# EAGLE design SFX100_LeonardoBreakout (EAGLE 9.3.2)
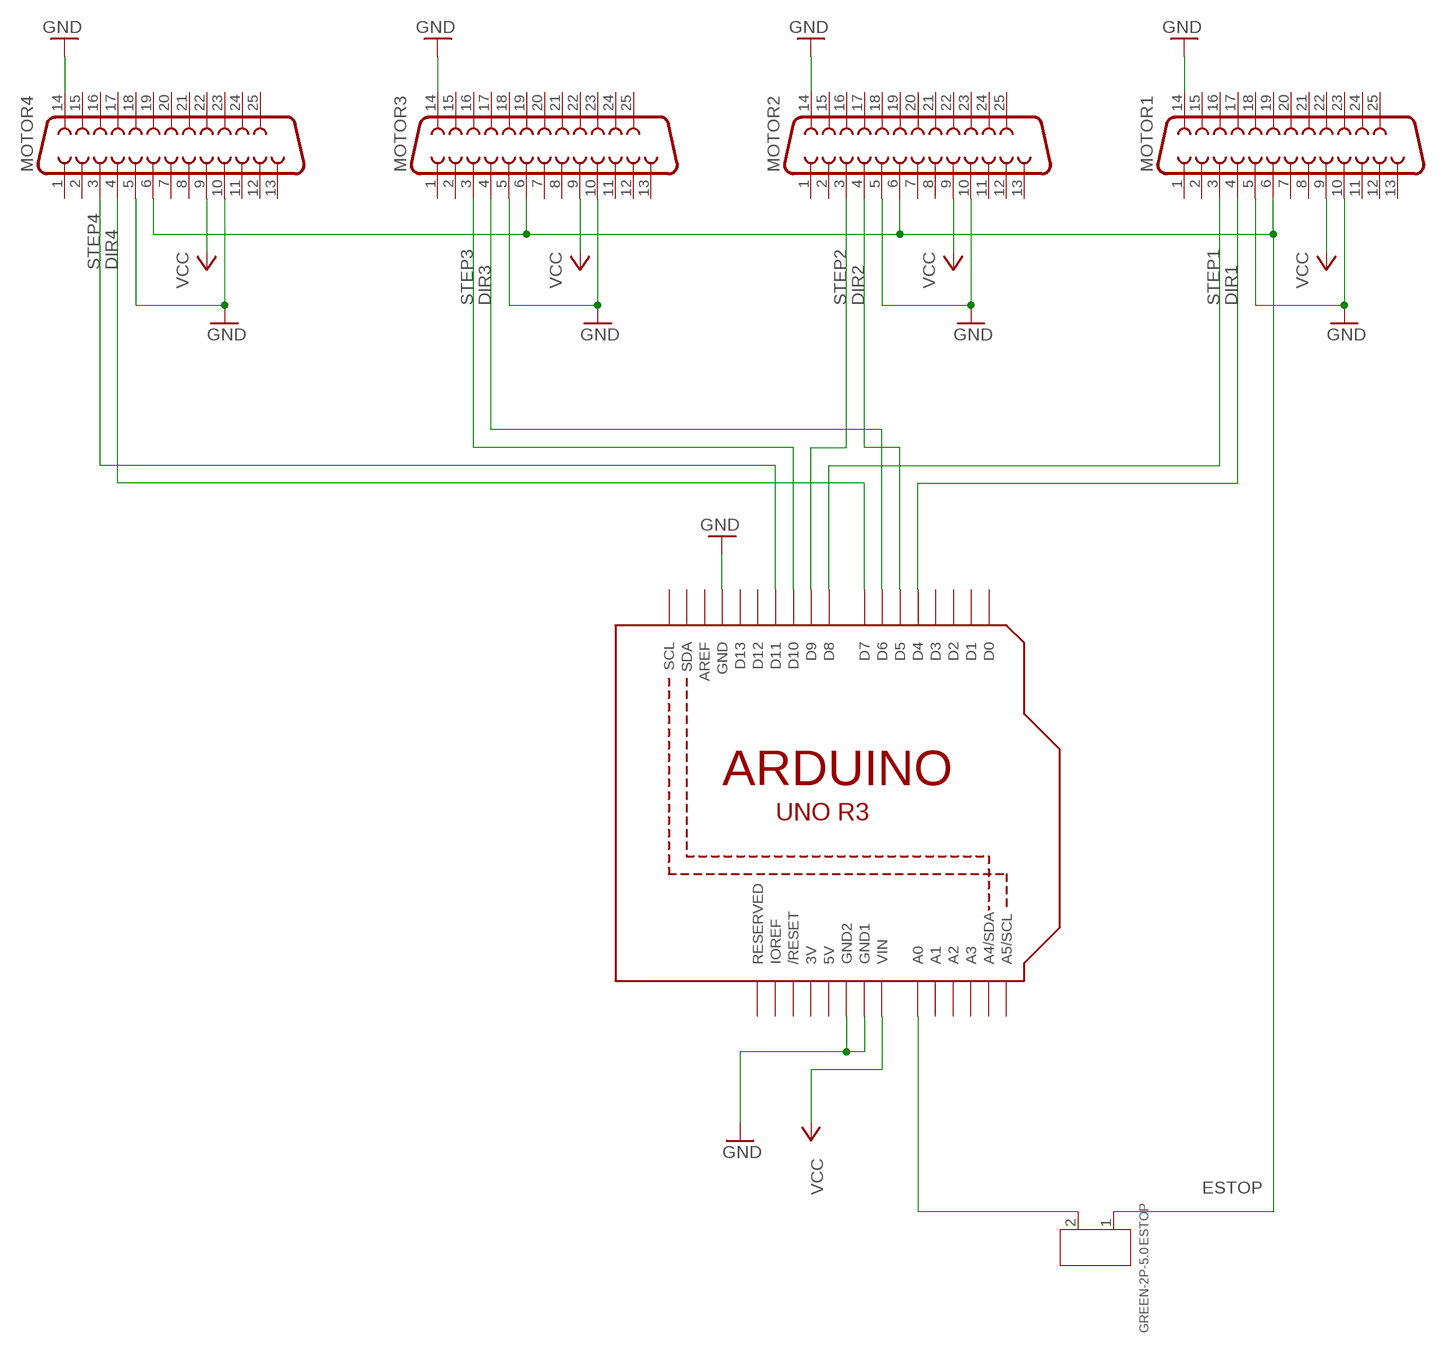
[diagram p0: schematic, sheet 1]

## Parts
ESTOP  GREEN-2P-5.0  SCREW-TERMINAL-GREEN(2P-5.0)  [H2-5.0-10.5X8.0MM]
MOTOR1  F25V  [F25V]
MOTOR2  F25V  [F25V]
MOTOR3  F25V  [F25V]
MOTOR4  F25V  [F25V]
U1  ARDUINOR3-BPLACE  [ARDUINOR3-BPLACE]

## Nets
DIR1: MOTOR1.4 U1.D4
DIR2: MOTOR2.4 U1.D5
DIR3: MOTOR3.4 U1.D6
DIR4: MOTOR4.4 U1.D7
ENA: ESTOP.2 U1.A0
ESTOP: ESTOP.1 MOTOR1.6 MOTOR2.6 MOTOR3.6 MOTOR4.6
GND: MOTOR1.5 MOTOR1.10 MOTOR1.14 MOTOR2.5 MOTOR2.10 MOTOR2.14 MOTOR3.5 MOTOR3.10 MOTOR3.14 MOTOR4.5 MOTOR4.10 MOTOR4.14 U1.GND U1.GND1 U1.GND2
STEP1: MOTOR1.3 U1.D8
STEP2: MOTOR2.3 U1.D9
STEP3: MOTOR3.3 U1.D10
STEP4: MOTOR4.3 U1.D11
VCC: MOTOR1.9 MOTOR2.9 MOTOR3.9 MOTOR4.9 U1.VIN
Unconnected: MOTOR1.1 MOTOR1.2 MOTOR1.7 MOTOR1.8 MOTOR1.11 MOTOR1.12 MOTOR1.13 MOTOR1.15 MOTOR1.16 MOTOR1.17 MOTOR1.18 MOTOR1.19 MOTOR1.20 MOTOR1.21 MOTOR1.22 MOTOR1.23 MOTOR1.24 MOTOR1.25 MOTOR2.1 MOTOR2.2 MOTOR2.7 MOTOR2.8 MOTOR2.11 MOTOR2.12 MOTOR2.13 MOTOR2.15 MOTOR2.16 MOTOR2.17 MOTOR2.18 MOTOR2.19 MOTOR2.20 MOTOR2.21 MOTOR2.22 MOTOR2.23 MOTOR2.24 MOTOR2.25 MOTOR3.1 MOTOR3.2 MOTOR3.7 MOTOR3.8 MOTOR3.11 MOTOR3.12 MOTOR3.13 MOTOR3.15 MOTOR3.16 MOTOR3.17 MOTOR3.18 MOTOR3.19 MOTOR3.20 MOTOR3.21 MOTOR3.22 MOTOR3.23 MOTOR3.24 MOTOR3.25 MOTOR4.1 MOTOR4.2 MOTOR4.7 MOTOR4.8 MOTOR4.11 MOTOR4.12 MOTOR4.13 MOTOR4.15 MOTOR4.16 MOTOR4.17 MOTOR4.18 MOTOR4.19 MOTOR4.20 MOTOR4.21 MOTOR4.22 MOTOR4.23 MOTOR4.24 MOTOR4.25 U1.A1 U1.A2 U1.A3 U1.A4(A4/SDA) U1.A5(A5/SCL) U1.AREF U1.D0 U1.D1 U1.D2 U1.D3 U1.D12 U1.D13 U1.IOREF U1.RESERVED U1.RESET(/RESET) U1.SCL U1.SDA

## Power pins joined to a net without a drawn wire
3V: U1.3V
5V: U1.5V

## Library data of the parts
ESTOP = OPL_Connector:SCREW-TERMINAL-GREEN(2P-5.0): 320110031
MOTOR1-MOTOR4 = con-subd:F25: SUB-D; OC_FARNELL: unknown; OC_NEWARK: unknown
U1 = adafruit:ARDUINOR3: This is a new object for the new Arduino R3 - with extra pins that you may want to use (such as IOref, and duplicated A4/A5

## Net classes
0 default: width 0.254 mm, clearance 0.254 mm

## Board
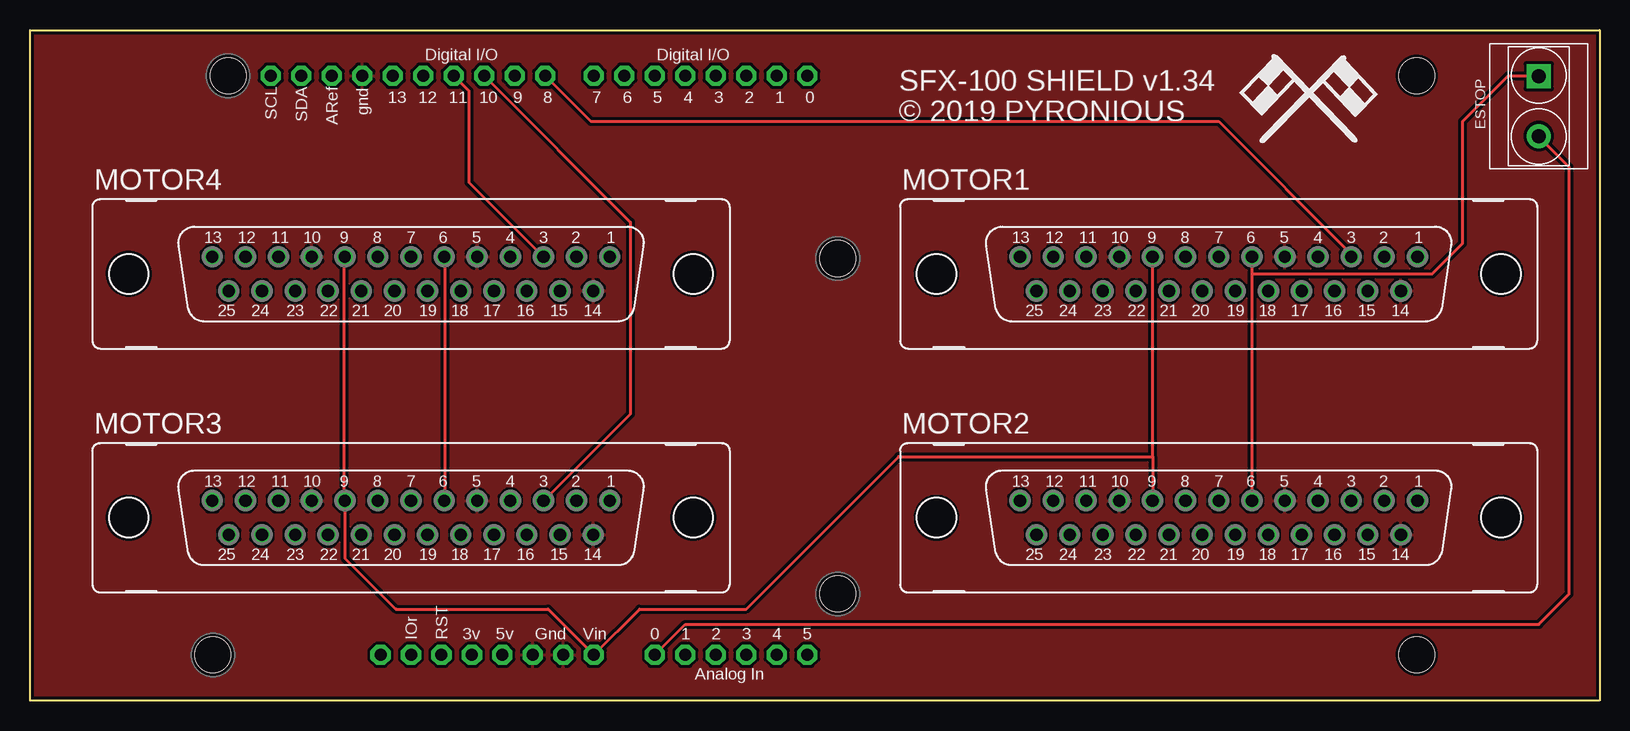
[diagram p1: board, top side]
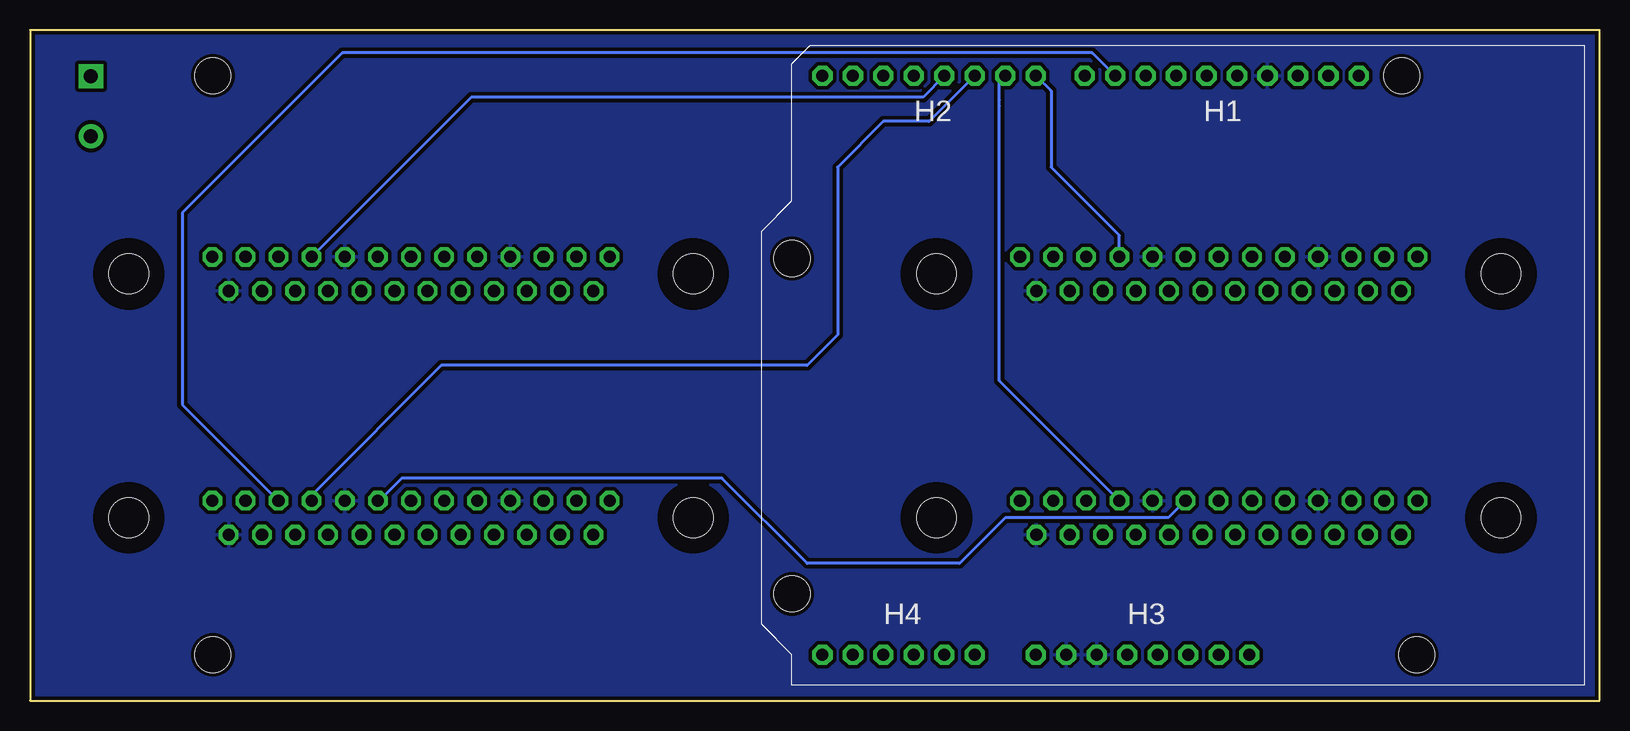
[diagram p2: board, bottom side, seen from below]

Size 130.81 x 55.88 mm. Coordinates in mm from the lower left corner, seen from the top.
Outline: 0,55.88 130.81,55.88 130.81,0 0,0 0,55.88
Copper layers (1*16): Top 0.035mm / dielectric 1.5mm / Bottom 0.035mm
Design rules "SparkFun": minimum track width 8mil, minimum drill 20mil, track to track 8mil, track to pad 8mil, pad to pad 8mil, via to via 8mil, smd to smd 8mil, copper to edge 10mil, drill to drill 8mil, minimum pad ring 12mil, minimum via ring 10mil, stop-mask expansion 4mil, vias tented up to drill 25mil, thermal gap 10mil
Holes 3 mm at 16.51,52.07 15.24,3.81 67.31,8.89 67.31,36.83 115.57,52.07 115.57,3.81

### Footprints (pad centres in the part's own frame; a part is rotated, then mirrored left to right if it is on the bottom)
H2-5.0-10.5X8.0MM = drill 1.168 pad 2.032 square: 1 0,2.5 | drill 1.168 pad 2.032: 2 0,-2.5
F25V = drill 1.016 octagon: 1 16.561,1.422; 2 13.792,1.422; 3 11.049,1.422; 4 8.28,1.422; 5 5.512,1.422; 6 2.769,1.422; 7 0,1.422; 8 -2.769,1.422; 9 -5.512,1.422; 10 -8.28,1.422; 11 -11.049,1.422; 12 -13.792,1.422; 13 -16.561,1.422; 14 15.189,-1.422; 15 12.421,-1.422; 16 9.652,-1.422; 17 6.909,-1.422; 18 4.14,-1.422; 19 1.372,-1.422; 20 -1.372,-1.422; 21 -4.14,-1.422; 22 -6.909,-1.422; 23 -9.652,-1.422; 24 -12.421,-1.422; 25 -15.189,-1.422 | hole 3.302: 23.52,0; -23.52,0
ARDUINOR3-BPLACE = drill 1 pad 1.676 octagon: 3V 35.56,2.54; 5V 38.1,2.54; A0 50.8,2.54; A1 53.34,2.54; A2 55.88,2.54; A3 58.42,2.54; A4 60.96,2.54; A5 63.5,2.54; AREF 23.876,50.8; D0 63.5,50.8; D1 60.96,50.8; D2 58.42,50.8; D3 55.88,50.8; D4 53.34,50.8; D5 50.8,50.8; D6 48.26,50.8; D7 45.72,50.8; D8 41.656,50.8; D9 39.116,50.8; D10 36.576,50.8; D11 34.036,50.8; D12 31.496,50.8; D13 28.956,50.8; GND 26.416,50.8; GND1 43.18,2.54; GND2 40.64,2.54; IOREF 30.48,2.54; RESERVED 27.94,2.54; RESET 33.02,2.54; SCL 18.796,50.8; SDA 21.336,50.8; VIN 45.72,2.54

### Placement (x,y rotation side)
ESTOP  125.73,49.53 0 top
MOTOR1  99.06,35.56 0 top
MOTOR2  99.06,15.24 0 top
MOTOR3  31.75,15.24 0 top
MOTOR4  31.75,35.56 0 top
U1  1.27,1.27 0 top

### Tracks (layer width: path | path; a pad name or v marks a point on that pad's centre or on a via)
DIR1
  Bottom 0.254: U1.D4 56.39,50.29 94.03,50.29 MOTOR1.4
DIR2
  Bottom 0.254: U1.D5 55.88,48.26 59.69,48.26 63.5,44.45 63.5,30.48 66.04,27.94 96.52,27.94 107.34,17.12 MOTOR2.4
DIR3
  Bottom 0.254: MOTOR3.4 50.04,26.67 50.04,49.53 50.04,50.04 50.04,51.56 U1.D6
DIR4
  Bottom 0.254: U1.D7 45.72,50.8 45.72,44.45 40.03,38.76 MOTOR4.4
ENA
  Top 0.254: U1.A0 54.61,6.35 125.73,6.35 128.27,8.89 128.27,44.45 125.73,46.99 ESTOP.2
ESTOP
  Top 0.254: MOTOR3.6 34.54,16.76 34.54,36.83 MOTOR4.6 | MOTOR2.6 101.85,16.76 101.83,16.79 101.83,35.56 | ESTOP.1 125.73,52.07 123.19,52.07 119.38,48.26 119.38,38.1 116.84,35.56 101.83,35.56 | MOTOR1.6 101.83,35.56
  Bottom 0.254: MOTOR2.6 101.6,16.76 99.82,18.54 73.15,18.54 66.04,11.43 53.34,11.43 49.53,15.24 35.94,15.24 MOTOR3.6
GND
  pour Top: 0,55.88 130.81,55.88 130.81,0 0,0
  pour Bottom (isolate 0.305): 0,55.88 130.81,55.88 130.81,0 0,0
STEP1
  Top 0.254: U1.D8 46.74,48.26 99.06,48.26 110.11,37.21 MOTOR1.3
STEP2
  Bottom 0.254: U1.D9 42.29,53.98 104.77,53.98 118.11,40.64 118.11,24.66 MOTOR2.3
STEP3
  Top 0.254: U1.D10 50.04,39.88 50.04,23.88 42.93,16.76 MOTOR3.3
STEP4
  Top 0.254: U1.D11 36.58,50.8 36.58,43.18 42.67,37.08 MOTOR4.3
VCC
  Top 0.254: MOTOR4.9 26.16,36.83 26.16,16.76 MOTOR3.9 26.24,11.86 30.48,7.62 43.18,7.62 U1.VIN 50.8,7.62 59.69,7.62 72.39,20.32 93.55,20.32 | 93.55,20.32 MOTOR1.9 | 93.55,20.32 MOTOR2.9

### Text on the board
tPlace: SFX-100 SHIELD v1.34 | © 2019 PYRONIOUS
bPlace: H1 | H2 | H3 | H4